# EAGLE design displayAdaptor (EAGLE 9.1.2)
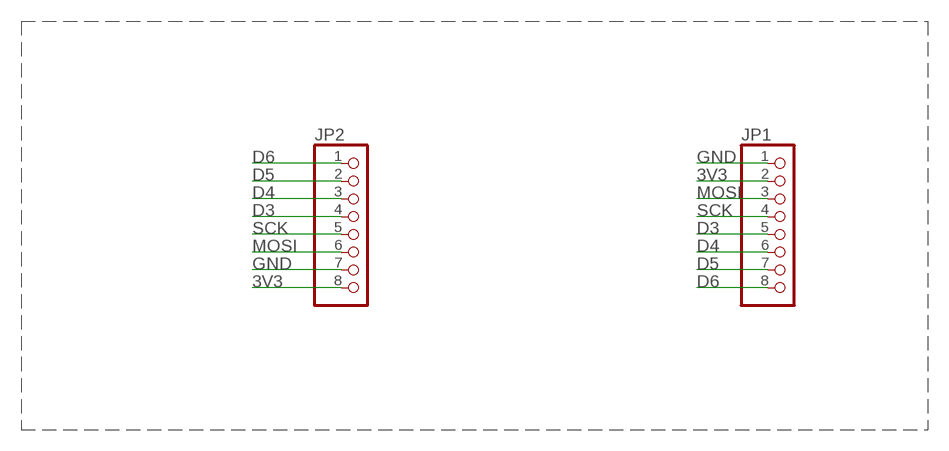
[diagram p0: schematic, sheet 1]

## Parts
JP1  PINHD-1X8  [1X08]
JP2  PINHD-1X8  [1X08]

## Nets
3V3: JP1.2 JP2.8
D3: JP1.5 JP2.4
D4: JP1.6 JP2.3
D5: JP1.7 JP2.2
D6: JP1.8 JP2.1
GND: JP1.1 JP2.7
MOSI: JP1.3 JP2.6
SCK: JP1.4 JP2.5

## Library data of the parts
JP1 JP2 = pinhead:PINHD-1X8: PIN HEADER

## Board
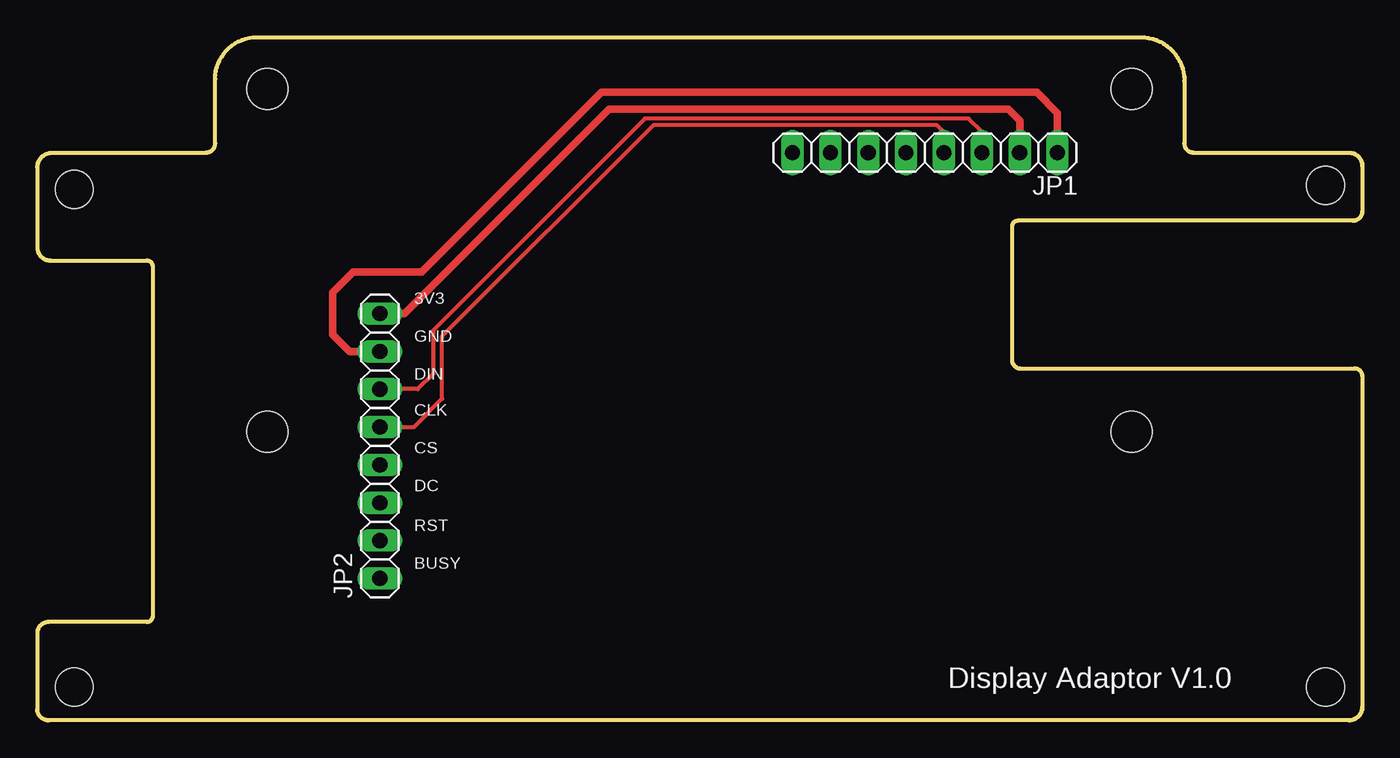
[diagram p1: board, top side]
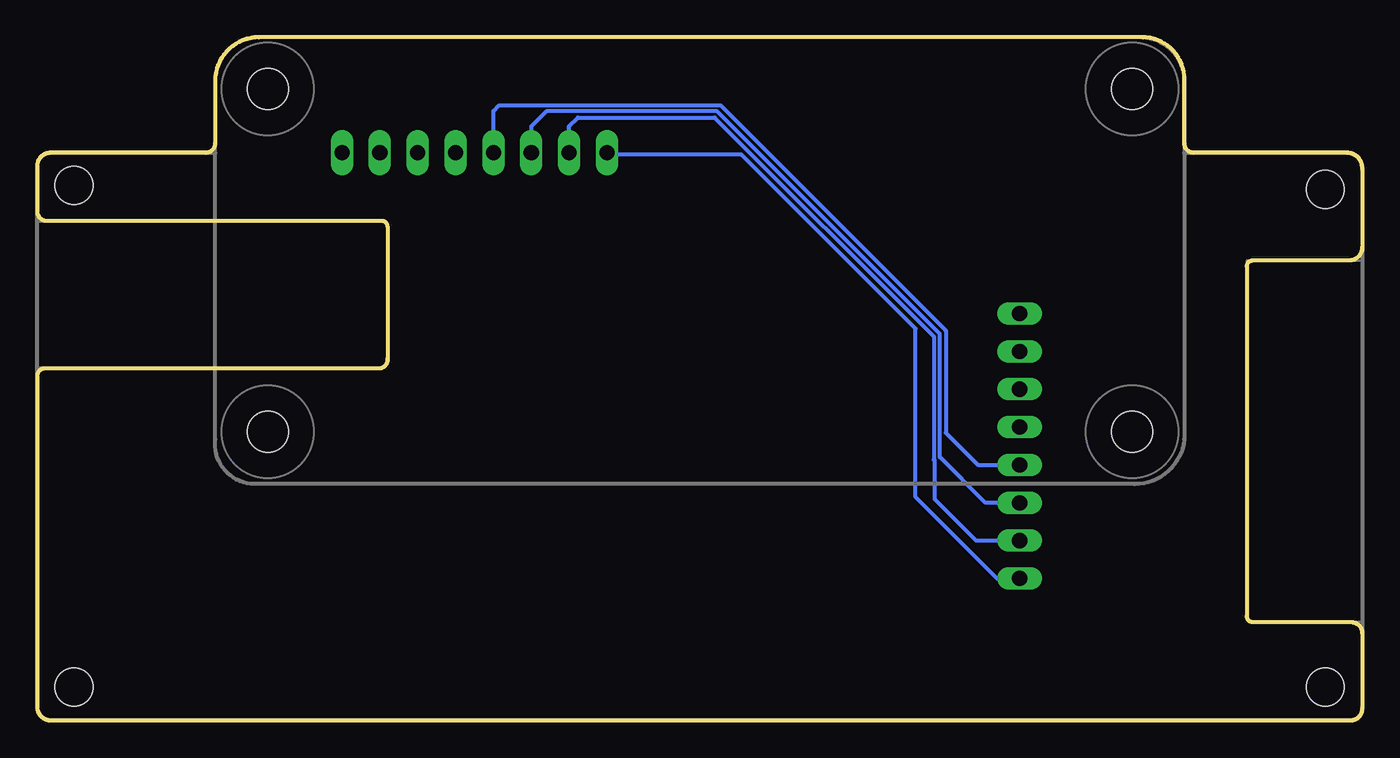
[diagram p2: board, bottom side, seen from below]

Size 88.9 x 45.85 mm. Coordinates in mm from the lower left corner, seen from the top.
Outline: 0,37.08 arc-90 1.02,38.1 11.3,38.1 arc90 11.94,38.73 11.94,43.05 arc-90 14.73,45.85 74.04,45.85 arc-90 76.96,42.93 76.96,38.73 arc90 77.6,38.1 88.01,38.1 arc-90 88.9,37.21 88.9,34.16 arc-90 88.27,33.53 65.79,33.53 arc90 65.41,33.15 65.41,24.26 arc90 65.91,23.62 88.39,23.62 arc-90 88.9,23.11 88.9,0.89 arc-90 88.01,0 0.76,0 arc-90 0,0.76 0,5.84 arc-90 0.76,6.6 7.37,6.6 arc90 7.75,6.99 7.75,30.48 arc90 7.37,30.86 0.89,30.86 arc-90 0,31.75 0,37.08
Copper layers (1*16): Top 0.035559375mm / dielectric 1.6mm / Bottom 0.035559375mm
Design rules "oshpark-2layer": minimum track width 6mil, minimum drill 10mil, track to track 6mil, track to pad 6mil, pad to pad 6mil, via to via 6mil, smd to smd 6mil, copper to edge 15mil, drill to drill 6mil, minimum pad ring 5mil, minimum via ring 5mil, stop-mask expansion 2.5mil, vias tented up to drill 0mil, thermal gap 10mil
Holes 2.75 mm at 15.44,19.38 15.44,42.38 73.44,19.38 73.44,42.38
Holes 2.54 mm at 2.48,35.64 2.48,2.24 86.43,2.24 86.43,35.9

### Footprints (pad centres in the part's own frame; a part is rotated, then mirrored left to right if it is on the bottom)
1X08 = drill 1.016 long: 1 -8.89,0; 2 -6.35,0; 3 -3.81,0; 4 -1.27,0; 5 1.27,0; 6 3.81,0; 7 6.35,0; 8 8.89,0

### Placement (x,y rotation side)
JP1  59.56,38.1 180 top
JP2  22.99,18.42 90 top

### Tracks (layer width: path | path; a pad name or v marks a point on that pad's centre or on a via)
3V3
  Top 0.508: JP2.8 24.64,27.31 38.35,41.02 65.15,41.02 65.91,40.26 JP1.2
D3
  Bottom 0.254: JP1.5 58.29,40.89 57.91,41.28 43.05,41.28 27.94,26.16 27.94,19.3 25.78,17.14 JP2.4
D4
  Bottom 0.254: JP2.3 25.27,14.61 28.35,17.68 28.35,25.93 43.28,40.87 54.74,40.87 55.75,39.85 JP1.6
D5
  Bottom 0.254: JP1.7 53.21,39.88 52.63,40.46 43.45,40.46 28.75,25.77 28.75,17.51 28.7,17.46 28.7,14.86 25.91,12.07 JP2.2
D6
  Bottom 0.254: JP2.1 24.51,9.53 29.97,14.99 29.97,26.29 41.66,37.97 50.55,37.97 JP1.8
GND
  Top 0.508: JP1.1 68.45,40.77 67.06,42.16 37.85,42.16 25.78,30.1 21.21,30.1 19.81,28.7 19.81,25.91 20.95,24.77 JP2.7
MOSI
  Top 0.254: JP1.3 63.37,39.5 62.48,40.39 40.77,40.39 26.54,26.16 26.54,23.24 25.53,22.22 JP2.6
SCK
  Top 0.254: JP2.5 25.27,19.68 27.18,21.59 27.18,25.78 41.38,39.98 60.33,39.98 60.83,39.47 JP1.4

### Text on the board
tPlace: 3V3 | GND | DIN | CLK | CS | DC | RST | BUSY | Display Adaptor V1.0